# Altium schematic sheet MainConnector.SchDoc
size A4
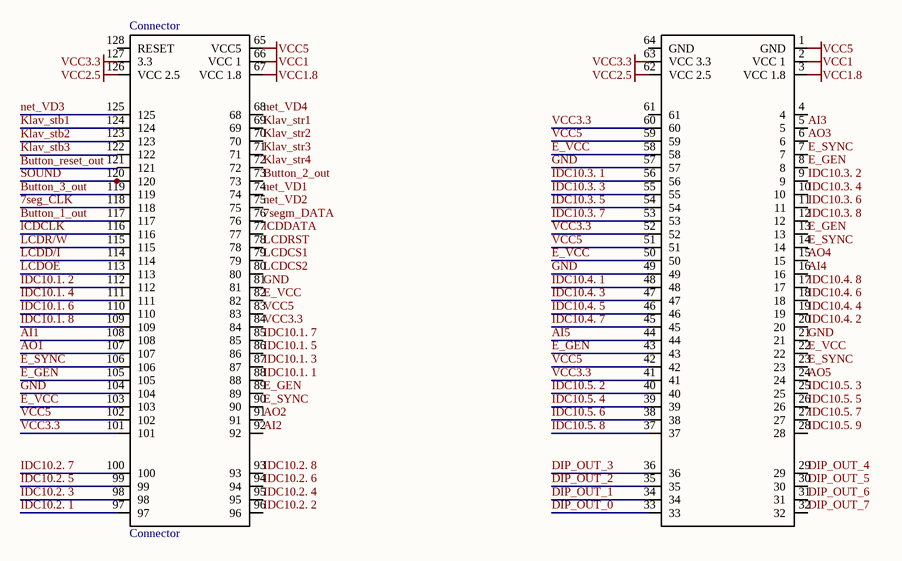
[diagram p0: MainConnector.SchDoc]

## Parts
Connector  Connector  [Connect]

## Nets
VCC1: Connector.2(VCC_1) Connector.66(VCC_1)
VCC1.8: Connector.3(VCC_1.8) Connector.67(VCC_1.8)
VCC2.5: Connector.62(VCC_2.5) Connector.126(VCC_2.5)
VCC3.3: Connector.41 Connector.52 Connector.60 Connector.63(VCC_3.3) Connector.84 Connector.101 Connector.127(3.3)
VCC5: Connector.1(GND) Connector.42 Connector.51 Connector.59 Connector.65(VCC5) Connector.83 Connector.102
7seg_CLK: Connector.118
7segm_DATA: Connector.76
AI1: Connector.108
AI2: Connector.92
AI3: Connector.5
AI4: Connector.16
AI5: Connector.44
AO1: Connector.107
AO2: Connector.91
AO3: Connector.6
AO4: Connector.15
AO5: Connector.24
Button_1_out: Connector.117
Button_2_out: Connector.73
Button_3_out: Connector.119
Button_reset_out: Connector.121
DIP_OUT_0: Connector.33
DIP_OUT_1: Connector.34
DIP_OUT_2: Connector.35
DIP_OUT_3: Connector.36
DIP_OUT_4: Connector.29
DIP_OUT_5: Connector.30
DIP_OUT_6: Connector.31
DIP_OUT_7: Connector.32
E_GEN: Connector.8 Connector.13 Connector.43 Connector.89 Connector.105
E_SYNC: Connector.7 Connector.14 Connector.23 Connector.90 Connector.106
E_VCC: Connector.22 Connector.50 Connector.58 Connector.82 Connector.103
GND: Connector.21 Connector.49 Connector.57 Connector.81 Connector.104
IDC10.1. 1: Connector.88
IDC10.1. 2: Connector.112
IDC10.1. 3: Connector.87
IDC10.1. 4: Connector.111
IDC10.1. 5: Connector.86
IDC10.1. 6: Connector.110
IDC10.1. 7: Connector.85
IDC10.1. 8: Connector.109
IDC10.2. 1: Connector.97
IDC10.2. 2: Connector.96
IDC10.2. 3: Connector.98
IDC10.2. 4: Connector.95
IDC10.2. 5: Connector.99
IDC10.2. 6: Connector.94
IDC10.2. 7: Connector.100
IDC10.2. 8: Connector.93
IDC10.3. 1: Connector.56
IDC10.3. 2: Connector.9
IDC10.3. 3: Connector.55
IDC10.3. 4: Connector.10
IDC10.3. 5: Connector.54
IDC10.3. 6: Connector.11
IDC10.3. 7: Connector.53
IDC10.3. 8: Connector.12
IDC10.4. 1: Connector.48
IDC10.4. 2: Connector.20
IDC10.4. 3: Connector.47
IDC10.4. 4: Connector.19
IDC10.4. 5: Connector.46
IDC10.4. 6: Connector.18
IDC10.4. 7: Connector.45
IDC10.4. 8: Connector.17
IDC10.5. 2: Connector.40
IDC10.5. 3: Connector.25
IDC10.5. 4: Connector.39
IDC10.5. 5: Connector.26
IDC10.5. 6: Connector.38
IDC10.5. 7: Connector.27
IDC10.5. 8: Connector.37
IDC10.5. 9: Connector.28
Klav_stb1: Connector.124
Klav_stb2: Connector.123
Klav_stb3: Connector.122
Klav_str1: Connector.69
Klav_str2: Connector.70
Klav_str3: Connector.71
Klav_str4: Connector.72
lCDCLK: Connector.116
LCDCS1: Connector.79
LCDCS2: Connector.80
LCDD/I: Connector.114
lCDDATA: Connector.77
LCDOE: Connector.113
LCDR/W: Connector.115
LCDRST: Connector.78
net_VD1: Connector.74
net_VD2: Connector.75
net_VD3: Connector.125
net_VD4: Connector.68
SOUND: Connector.120

Not connected (* = marked no-connect by the designer): Connector 4 61 64(GND) 128(RESET)